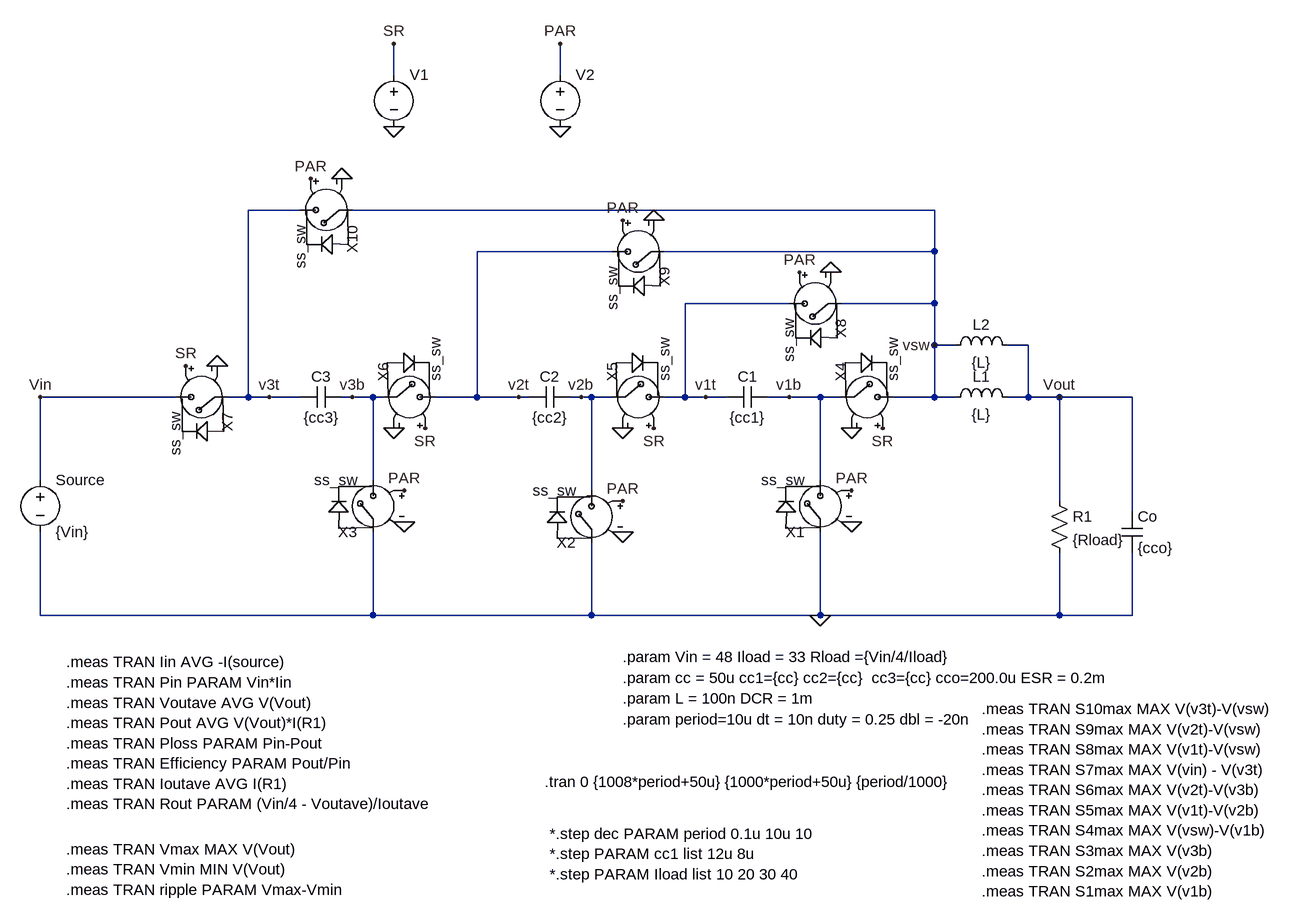
[diagram p0: schematic 4to1_soft_charging_48V.asc]
4to1_soft_charging_48V.asc, the LTspice schematic file:
Version 4
SHEET 1 2036 1112
WIRE -240 -480 -240 -528
WIRE 16 -480 16 -528
WIRE -384 -272 -464 -272
WIRE 592 -272 -304 -272
WIRE 96 -208 -112 -208
WIRE 592 -208 592 -272
WIRE 592 -208 176 -208
WIRE 368 -128 208 -128
WIRE 592 -128 592 -208
WIRE 592 -128 448 -128
WIRE 592 -64 592 -128
WIRE 624 -64 592 -64
WIRE 736 -64 704 -64
WIRE -576 16 -784 16
WIRE -464 16 -464 -272
WIRE -464 16 -496 16
WIRE -432 16 -464 16
WIRE -384 16 -432 16
WIRE -304 16 -320 16
WIRE -272 16 -304 16
WIRE -256 16 -272 16
WIRE -112 16 -112 -208
WIRE -112 16 -176 16
WIRE -48 16 -112 16
WIRE -32 16 -48 16
WIRE 48 16 32 16
WIRE 64 16 48 16
WIRE 96 16 64 16
WIRE 208 16 208 -128
WIRE 208 16 176 16
WIRE 240 16 208 16
WIRE 272 16 240 16
WIRE 368 16 336 16
WIRE 416 16 368 16
WIRE 448 16 416 16
WIRE 592 16 592 -64
WIRE 592 16 528 16
WIRE 624 16 592 16
WIRE 736 16 736 -64
WIRE 736 16 704 16
WIRE 784 16 736 16
WIRE 896 16 784 16
WIRE -784 144 -784 16
WIRE -272 144 -272 16
WIRE 416 144 416 16
WIRE 64 160 64 16
WIRE 784 176 784 16
WIRE 896 192 896 16
WIRE -784 352 -784 224
WIRE -272 352 -272 224
WIRE -272 352 -784 352
WIRE 64 352 64 240
WIRE 64 352 -272 352
WIRE 416 352 416 224
WIRE 416 352 64 352
WIRE 784 352 784 256
WIRE 784 352 416 352
WIRE 896 352 896 256
WIRE 896 352 784 352
FLAG 16 -400 0
FLAG 16 -528 PAR
FLAG 416 352 0
FLAG 112 64 0
FLAG 464 64 0
FLAG 464 208 0
FLAG 432 -176 0
FLAG 384 -176 PAR
FLAG 464 160 PAR
FLAG 160 64 SR
FLAG 512 64 SR
FLAG -784 16 Vin
FLAG -48 16 v2t
FLAG 240 16 v1t
FLAG 784 16 Vout
FLAG -192 64 SR
FLAG 112 -256 PAR
FLAG 112 176 PAR
FLAG -240 64 0
FLAG 160 -256 0
FLAG 112 224 0
FLAG 48 16 v2b
FLAG -368 -320 PAR
FLAG -320 -320 0
FLAG -512 -32 0
FLAG -560 -32 SR
FLAG -224 160 PAR
FLAG -224 208 0
FLAG -432 16 v3t
FLAG -304 16 v3b
FLAG 368 16 v1b
FLAG -240 -400 0
FLAG -240 -528 SR
FLAG 592 -64 vsw
SYMBOL voltage 16 -496 R0
WINDOW 123 0 0 Left 2
WINDOW 39 0 0 Left 2
WINDOW 3 24 96 Invisible 2
SYMATTR Value PULSE(0 1 {period*duty+dt*0.65} 1p 1p {(period-dt)*(1-duty)-dt} {period})
SYMATTR InstName V2
SYMBOL voltage -784 128 R0
WINDOW 123 0 0 Left 2
WINDOW 39 0 0 Left 2
SYMATTR InstName Source
SYMATTR Value {Vin}
SYMBOL cap 272 32 R270
WINDOW 0 32 32 VTop 2
WINDOW 3 0 32 VBottom 2
SYMATTR InstName C1
SYMATTR Value {cc1}
SYMATTR SpiceLine Rser = {ESR} ic = {Vin/4}
SYMBOL cap 880 192 R0
SYMATTR InstName Co
SYMATTR Value {cco}
SYMATTR Value2 Rser = {ESR} ic = {Vin/4}
SYMBOL cap -32 32 R270
WINDOW 0 32 32 VTop 2
WINDOW 3 0 32 VBottom 2
SYMATTR InstName C2
SYMATTR Value {cc2}
SYMATTR SpiceLine Rser = {ESR} ic = {Vin/4}
SYMBOL cap -384 32 R270
WINDOW 0 32 32 VTop 2
WINDOW 3 0 32 VBottom 2
SYMATTR InstName C3
SYMATTR Value {cc3}
SYMATTR SpiceLine Rser = {ESR} ic = {Vin/4}
SYMBOL voltage -240 -496 R0
WINDOW 123 0 0 Left 2
WINDOW 39 0 0 Left 2
WINDOW 3 24 96 Invisible 2
SYMATTR Value PULSE(0 1 0 1p 1p {(period-dt)*duty+dbl} {period})   )
SYMATTR InstName V1
SYMBOL ss_sw 416 240 R180
SYMATTR SpiceLine ron = 1m
SYMATTR InstName X1
SYMBOL ss_sw 64 256 R180
SYMATTR SpiceLine ron = 1m
SYMATTR InstName X2
SYMBOL ss_sw -272 240 R180
SYMATTR InstName X3
SYMATTR SpiceLine ron = 1m
SYMBOL ss_sw 432 16 R270
SYMATTR SpiceLine ron = 0.68m
SYMATTR InstName X4
SYMBOL ss_sw 80 16 R270
SYMATTR InstName X5
SYMATTR SpiceLine ron = 0.68m
SYMBOL ss_sw -272 16 R270
SYMATTR SpiceLine ron = 0.68m
SYMATTR InstName X6
SYMBOL ss_sw -480 16 R90
SYMATTR SpiceLine ron = 2m
SYMATTR InstName X7
SYMBOL ss_sw 464 -128 R90
SYMATTR InstName X8
SYMATTR SpiceLine ron = 1m
SYMBOL ss_sw 192 -208 R90
SYMATTR InstName X9
SYMATTR SpiceLine ron = 1m
SYMBOL ss_sw -288 -272 R90
SYMATTR InstName X10
SYMATTR SpiceLine ron = 1m
SYMBOL res 768 160 R0
SYMATTR InstName R1
SYMATTR Value {Rload}
SYMBOL ind 608 32 R270
WINDOW 0 32 56 VTop 2
WINDOW 3 5 56 VBottom 2
SYMATTR InstName L1
SYMATTR Value {L}
SYMATTR SpiceLine Rser={DCR} Rpar=10k
SYMBOL ind 608 -48 R270
WINDOW 0 32 56 VTop 2
WINDOW 3 5 56 VBottom 2
SYMATTR InstName L2
SYMATTR Value {L}
SYMATTR SpiceLine Rser={DCR} Rpar=10k
TEXT -8 608 Left 2 !.tran 0 {1008*period+50u} {1000*period+50u} {period/1000}
TEXT -744 424 Left 2 !.meas TRAN Iin AVG -I(source)\n.meas TRAN Pin PARAM Vin*Iin\n.meas TRAN Voutave AVG V(Vout)\n.meas TRAN Pout AVG V(Vout)*I(R1)\n.meas TRAN Ploss PARAM Pin-Pout\n.meas TRAN Efficiency PARAM Pout/Pin\n.meas TRAN Ioutave AVG I(R1)\n.meas TRAN Rout PARAM (Vin/4 - Voutave)/Ioutave
TEXT 112 448 Left 2 !.param cc = 50u cc1={cc} cc2={cc}  cc3={cc} cco=200.0u ESR = 0.2m
TEXT 0 688 Left 2 !*.step dec PARAM period 0.1u 10u 10\n*.step PARAM cc1 list 12u 8u\n*.step PARAM Iload list 10 20 30 40
TEXT -744 712 Left 2 !.meas TRAN Vmax MAX V(Vout)\n.meas TRAN Vmin MIN V(Vout)\n.meas TRAN ripple PARAM Vmax-Vmin
TEXT 112 416 Left 2 !.param Vin = 48 Iload = 33 Rload ={Vin/4/Iload}
TEXT 112 512 Left 2 !.param period=10u dt = 10n duty = 0.25 dbl = -20n
TEXT 112 480 Left 2 !.param L = 100n DCR = 1m
TEXT 664 496 Left 2 !.meas TRAN S10max MAX V(v3t)-V(vsw)\n.meas TRAN S9max MAX V(v2t)-V(vsw)\n.meas TRAN S8max MAX V(v1t)-V(vsw)\n.meas TRAN S7max MAX V(vin) - V(v3t)\n.meas TRAN S6max MAX V(v2t)-V(v3b)\n.meas TRAN S5max MAX V(v1t)-V(v2b)\n.meas TRAN S4max MAX V(vsw)-V(v1b)\n.meas TRAN S3max MAX V(v3b)\n.meas TRAN S2max MAX V(v2b)\n.meas TRAN S1max MAX V(v1b)

The netlist it stands for:
* 4to1_soft_charging_48V.asc
V2 PAR 0 PULSE(0 1 {period*duty+dt*0.65} 1p 1p {(period-dt)*(1-duty)-dt} {period})
V§Source Vin 0 {Vin}
C1 v1t v1b {cc1} Rser = {ESR} ic = {Vin/4}
Co Vout 0 {cco} Rser = {ESR} ic = {Vin/4}
C2 v2t v2b {cc2} Rser = {ESR} ic = {Vin/4}
C3 v3t v3b {cc3} Rser = {ESR} ic = {Vin/4}
V1 SR 0 PULSE(0 1 0 1p 1p {(period-dt)*duty+dbl} {period})   )
XX1 0 v1b PAR 0 ss_sw ron = 1m  ; pins A B NC+ NC-
XX2 0 v2b PAR 0 ss_sw ron = 1m  ; pins A B NC+ NC-
XX3 0 v3b PAR 0 ss_sw ron = 1m  ; pins A B NC+ NC-
XX4 v1b vsw SR 0 ss_sw ron = 0.68m  ; pins A B NC+ NC-
XX5 v2b v1t SR 0 ss_sw ron = 0.68m  ; pins A B NC+ NC-
XX6 v3b v2t SR 0 ss_sw ron = 0.68m  ; pins A B NC+ NC-
XX7 v3t Vin SR 0 ss_sw ron = 2m  ; pins A B NC+ NC-
XX8 vsw v1t PAR 0 ss_sw ron = 1m  ; pins A B NC+ NC-
XX9 vsw v2t PAR 0 ss_sw ron = 1m  ; pins A B NC+ NC-
XX10 vsw v3t PAR 0 ss_sw ron = 1m  ; pins A B NC+ NC-
R1 Vout 0 {Rload}
L1 vsw Vout {L} Rser={DCR} Rpar=10k
L2 vsw Vout {L} Rser={DCR} Rpar=10k
.tran 0 {1008*period+50u} {1000*period+50u} {period/1000}
.meas TRAN Iin AVG -I(source)
.meas TRAN Pin PARAM Vin*Iin
.meas TRAN Voutave AVG V(Vout)
.meas TRAN Pout AVG V(Vout)*I(R1)
.meas TRAN Ploss PARAM Pin-Pout
.meas TRAN Efficiency PARAM Pout/Pin
.meas TRAN Ioutave AVG I(R1)
.meas TRAN Rout PARAM (Vin/4 - Voutave)/Ioutave
.param cc = 50u cc1={cc} cc2={cc}  cc3={cc} cco=200.0u ESR = 0.2m
*.step dec PARAM period 0.1u 10u 10
*.step PARAM cc1 list 12u 8u
*.step PARAM Iload list 10 20 30 40
.meas TRAN Vmax MAX V(Vout)
.meas TRAN Vmin MIN V(Vout)
.meas TRAN ripple PARAM Vmax-Vmin
.param Vin = 48 Iload = 33 Rload ={Vin/4/Iload}
.param period=10u dt = 10n duty = 0.25 dbl = -20n
.param L = 100n DCR = 1m
.meas TRAN S10max MAX V(v3t)-V(vsw)
.meas TRAN S9max MAX V(v2t)-V(vsw)
.meas TRAN S8max MAX V(v1t)-V(vsw)
.meas TRAN S7max MAX V(vin) - V(v3t)
.meas TRAN S6max MAX V(v2t)-V(v3b)
.meas TRAN S5max MAX V(v1t)-V(v2b)
.meas TRAN S4max MAX V(vsw)-V(v1b)
.meas TRAN S3max MAX V(v3b)
.meas TRAN S2max MAX V(v2b)
.meas TRAN S1max MAX V(v1b)
.backanno
.end